# Altium schematic sheet jetson_nano_module.SchDoc: Jetson Nano Module
size A3; Author: Olexandr Gudozhnik; Organization: EPFL-STI-LIS; Address1: EPFL, Station 9; Address2: 1015, Lausanne; Address3: Switzerland; DocumentNumber: 3; SheetNumber: 3; SheetTotal: 8
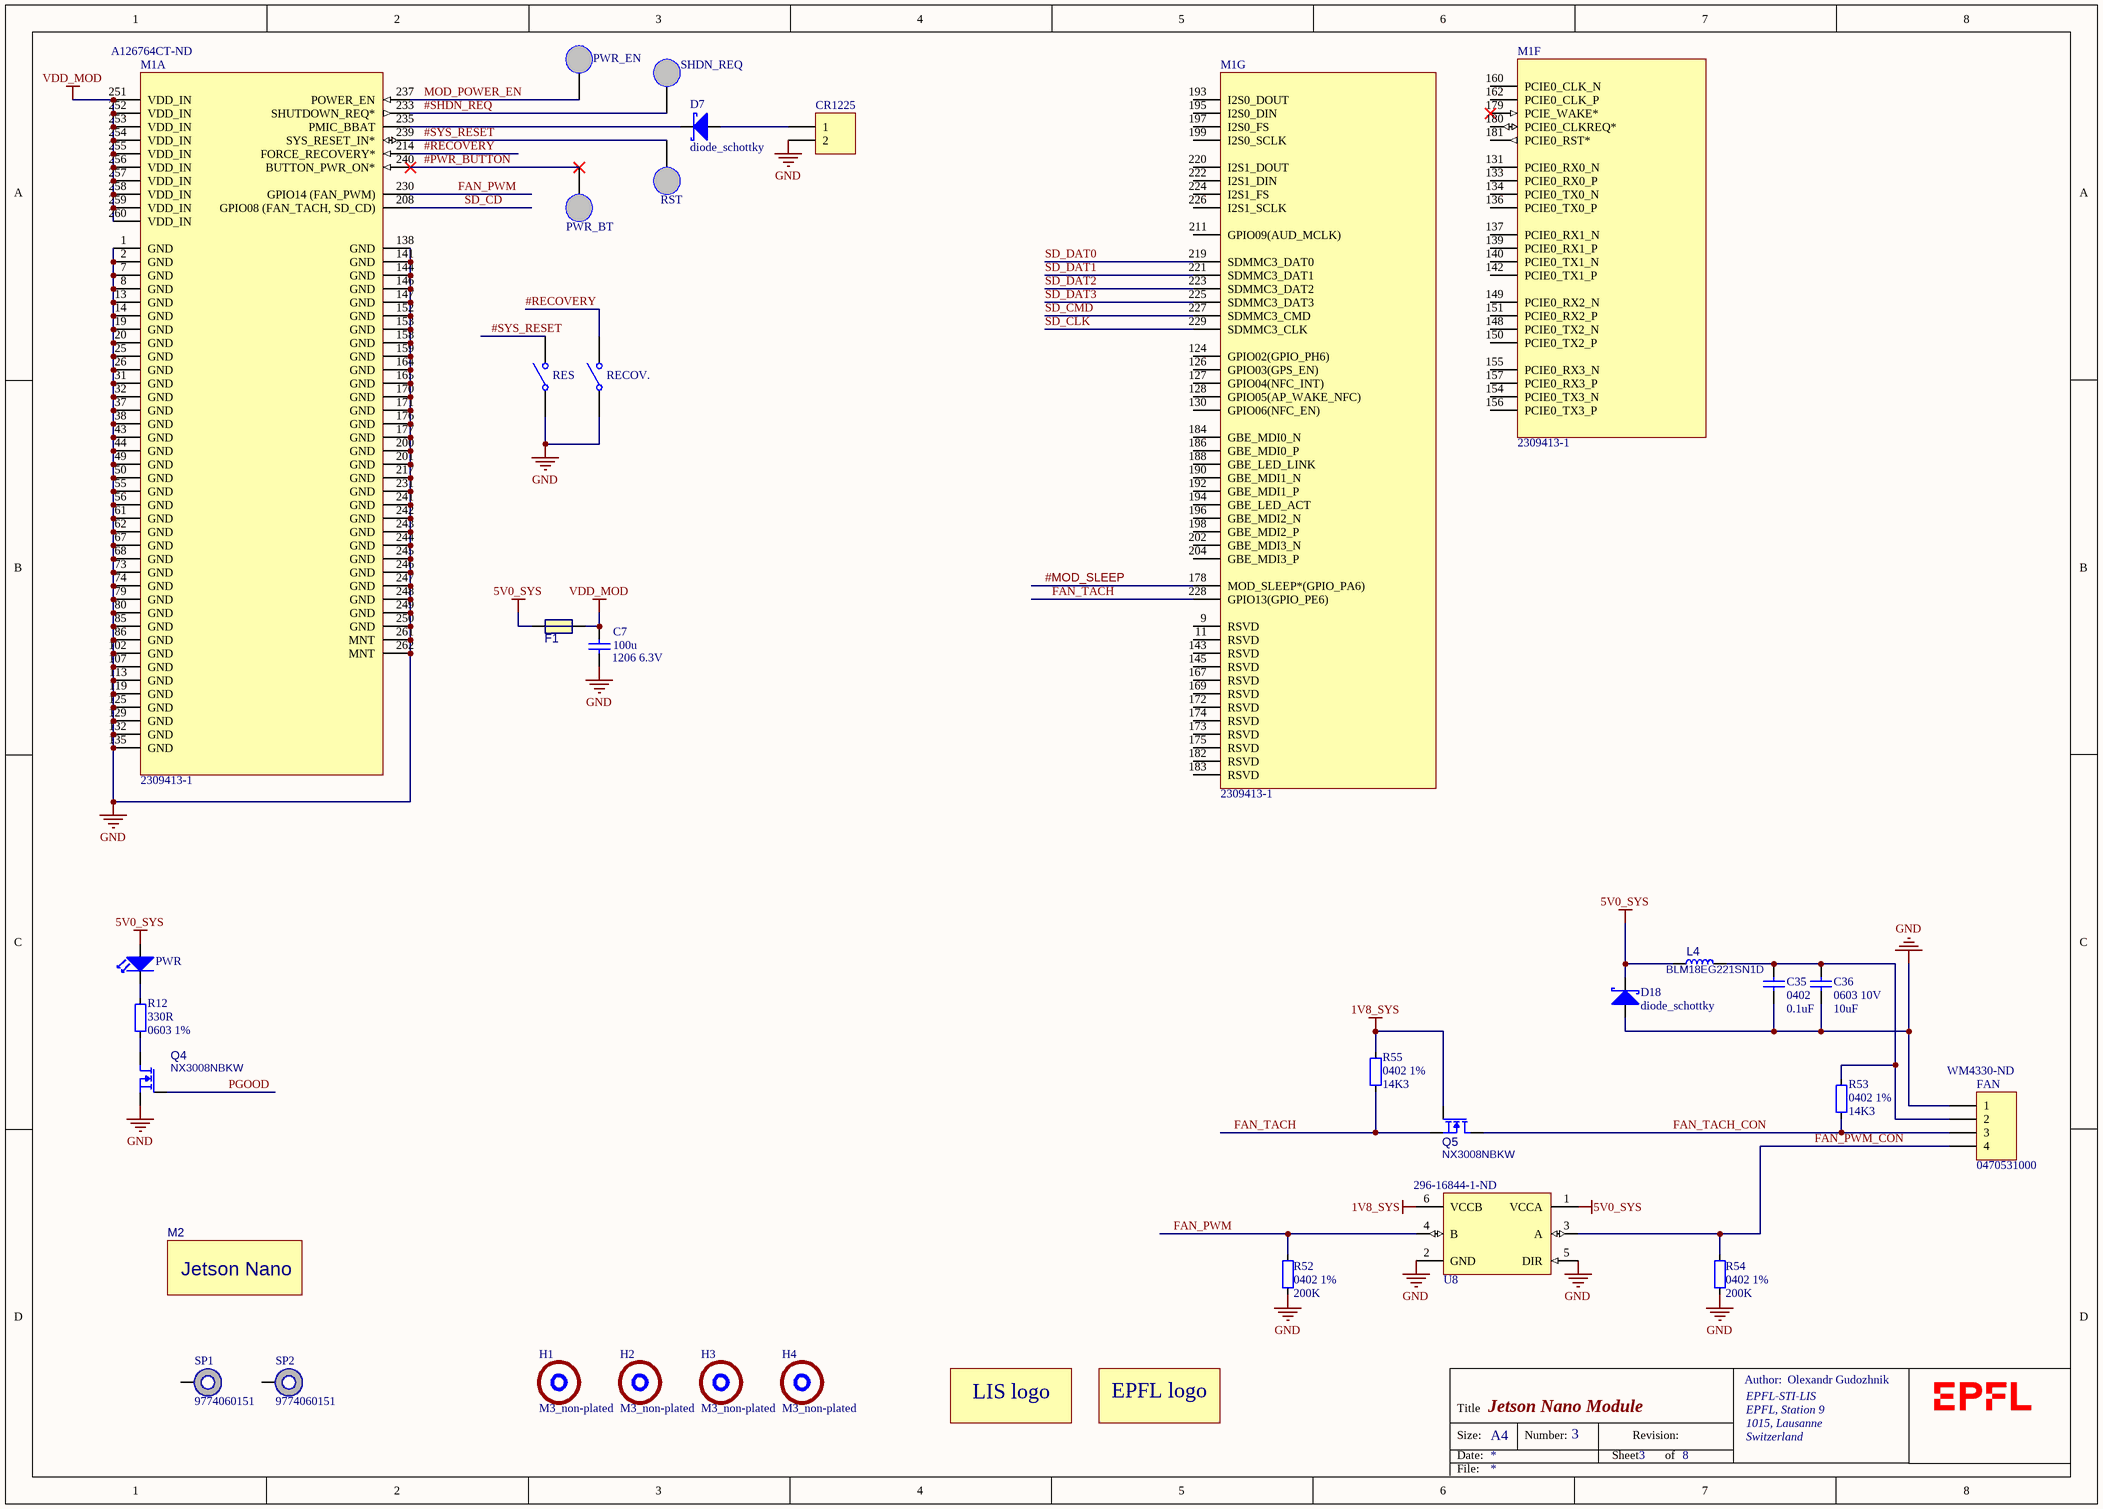
[diagram p0: jetson_nano_module.SchDoc]

## Parts
C7  1206 6.3V  value 100u  [cap1206]
C35  0402  value 0.1uF  [cap0402]
C36  0603 10V  value 10uF  [cap0603]
CR1225  Header 2  [CR1225_Holder]  (value not drawn)
D7  diode_schottky  [DFN1608D-2]
D18  diode_schottky  [DFN1608D-2]
F1  1206L450SLWR  [res1206]  (value not drawn)
FAN  0470531000  Supplier Part Number 1: WM4330-ND  [47053-1000]
H1  M3_non-plated  [M3_NON_PLATED]  (no BOM)
H2  M3_non-plated  [M3_NON_PLATED]  (no BOM)
H3  M3_non-plated  [M3_NON_PLATED]  (no BOM)
H4  M3_non-plated  [M3_NON_PLATED]  (no BOM)
L4  BLM18EG221SN1D  [fb0603]
logo1  LIS_LOGO  [lis_logo]  (value not drawn)  (graphical)
logo2  EPFL_LOGO  [epfl_logo]  (value not drawn)  (graphical)
M1  2309413-1  Supplier Part Number 1: A126764CT-ND  [jetson-nano-connector]  (parts A,F,G of 7)
M2  (no value)  [jetson-nano-module]  (no BOM)
PWR  green LED  [led_0603]  (value not drawn)
PWR_BT  TP  [test_point]  (value not drawn)  (no BOM)
PWR_EN  TP  [test_point]  (value not drawn)  (no BOM)
Q4  NX3008NBKW  [SC70-3]
Q5  NX3008NBKW  [SC70-3]
R12  0603 1%  value 330R  [res0603]
R52  0402 1%  value 200K  [res0402]
R53  0402 1%  value 14K3  [res0402]
R54  0402 1%  value 200K  [res0402]
R55  0402 1%  value 14K3  [res0402]
RECOV.  B3U1000P  [b3u_1000p]  (value not drawn)
RES  B3U1000P  [b3u_1000p]  (value not drawn)
RST  TP  [test_point]  (value not drawn)  (no BOM)
SHDN_REQ  TP  [test_point]  (value not drawn)  (no BOM)
SP1  9774060151  [M2.5-6mm]  (mechanical)
SP2  9774060151  [M2.5-6mm]  (mechanical)
U8  Supplier Part Number 1: 296-16844-1-ND  [SC70-6]  (hidden comment: SN74LVC1T45)

## Nets
1V8_SYS: Q5.1(G) R55.1 U8.6(VCCB)
5V0_SYS: D18.1(K) F1.1 L4.1 PWR.1(A) U8.1(VCCA)
GND: C7.2 C35.1 C36.2 CR1225.2 D18.2(A) FAN.1 M1.1(GND) M1.2(GND) M1.7(GND) M1.8(GND) M1.13(GND) M1.14(GND) M1.19(GND) M1.20(GND) M1.25(GND) M1.26(GND) M1.31(GND) M1.32(GND) M1.37(GND) M1.38(GND) M1.43(GND) M1.44(GND) M1.49(GND) M1.50(GND) M1.55(GND) M1.56(GND) M1.61(GND) M1.62(GND) M1.67(GND) M1.68(GND) M1.73(GND) M1.74(GND) M1.79(GND) M1.80(GND) M1.85(GND) M1.86(GND) M1.102(GND) M1.107(GND) M1.113(GND) M1.119(GND) M1.125(GND) M1.129(GND) M1.132(GND) M1.135(GND) M1.138(GND) M1.141(GND) M1.144(GND) M1.146(GND) M1.147(GND) M1.152(GND) M1.153(GND) M1.158(GND) M1.159(GND) M1.164(GND) M1.165(GND) M1.170(GND) M1.171(GND) M1.176(GND) M1.177(GND) M1.200(GND) M1.201(GND) M1.217(GND) M1.231(GND) M1.241(GND) M1.242(GND) M1.243(GND) M1.244(GND) M1.245(GND) M1.246(GND) M1.247(GND) M1.248(GND) M1.249(GND) M1.250(GND) M1.261(MNT) M1.262(MNT) Q4.2(S) R52.2 R54.2 RECOV..1(COMMON) RES.1(COMMON) U8.2(GND) U8.5(DIR)
VDD_MOD: C7.1 F1.2 M1.251(VDD_IN) M1.252(VDD_IN) M1.253(VDD_IN) M1.254(VDD_IN) M1.255(VDD_IN) M1.256(VDD_IN) M1.257(VDD_IN) M1.258(VDD_IN) M1.259(VDD_IN) M1.260(VDD_IN)
#MOD_SLEEP: M1.178(MOD_SLEEP*(GPIO_PA6))
#PWR_BUTTON: M1.240(BUTTON_PWR_ON*) PWR_BT.1(TP)
#RECOVERY: M1.214(FORCE_RECOVERY*) RECOV..2(NO)
#SHDN_REQ: M1.233(SHUTDOWN_REQ*) SHDN_REQ.1(TP)
#SYS_RESET: M1.239(SYS_RESET_IN*) RES.2(NO) RST.1(TP)
FAN_PWM: M1.230(GPIO14_(FAN_PWM)) R52.1 U8.4(B)
FAN_PWM_CON: FAN.4 R54.1 U8.3(A)
FAN_TACH: M1.228(GPIO13(GPIO_PE6)) Q5.2(S) R55.2
FAN_TACH_CON: FAN.3 Q5.3(D) R53.2
MOD_POWER_EN: M1.237(POWER_EN) PWR_EN.1(TP)
PGOOD: Q4.1(G)
SD_CD: M1.208(GPIO08_(FAN_TACH,_SD_CD))
SD_CLK: M1.229(SDMMC3_CLK)
SD_CMD: M1.227(SDMMC3_CMD)
SD_DAT0: M1.219(SDMMC3_DAT0)
SD_DAT1: M1.221(SDMMC3_DAT1)
SD_DAT2: M1.223(SDMMC3_DAT2)
SD_DAT3: M1.225(SDMMC3_DAT3)
NetC35_2: C35.2 C36.1 FAN.2 L4.2 R53.1
NetCR1225_1: CR1225.1 D7.2(A)
NetD7_1: D7.1(K) M1.235(PMIC_BBAT)
NetPWR_2: PWR.2(K) R12.2
NetQ4_3: Q4.3(D) R12.1

Not connected (* = marked no-connect by the designer): M1 9(RSVD) 11(RSVD) 124(GPIO02(GPIO_PH6)) 126(GPIO03(GPS_EN)) 127(GPIO04(NFC_INT)) 128(GPIO05(AP_WAKE_NFC)) 130(GPIO06(NFC_EN)) 131(PCIE0_RX0_N) 133(PCIE0_RX0_P) 134(PCIE0_TX0_N) 136(PCIE0_TX0_P) 137(PCIE0_RX1_N) 139(PCIE0_RX1_P) 140(PCIE0_TX1_N) 142(PCIE0_TX1_P) 143(RSVD) 145(RSVD) 148(PCIE0_TX2_N) 149(PCIE0_RX2_N) 150(PCIE0_TX2_P) 151(PCIE0_RX2_P) 154(PCIE0_TX3_N) 155(PCIE0_RX3_N) 156(PCIE0_TX3_P) 157(PCIE0_RX3_P) 160(PCIE0_CLK_N) 162(PCIE0_CLK_P) 167(RSVD) 169(RSVD) 172(RSVD) 173(RSVD) 174(RSVD) 175(RSVD) 179(PCIE_WAKE*)* 180(PCIE0_CLKREQ*) 181(PCIE0_RST*) 182(RSVD) 183(RSVD) 184(GBE_MDI0_N) 186(GBE_MDI0_P) 188(GBE_LED_LINK) 190(GBE_MDI1_N) 192(GBE_MDI1_P) 193(I2S0_DOUT) 194(GBE_LED_ACT) 195(I2S0_DIN) 196(GBE_MDI2_N) 197(I2S0_FS) 198(GBE_MDI2_P) 199(I2S0_SCLK) 202(GBE_MDI3_N) 204(GBE_MDI3_P) 211(GPIO09(AUD_MCLK)) 220(I2S1_DOUT) 222(I2S1_DIN) 224(I2S1_FS) 226(I2S1_SCLK); SP1 1; SP2 1

## Notes on the sheet
- Author:
- Title
- Size:
- Date:
- A4
- Number:
- Sheet
- Revision:
- of
- File:
- (in symbol EPFL_LOGO) EPFL logo
- (in symbol jetson-nano-module) Jetson Nano
- (in symbol LIS_LOGO) LIS logo

## Library data of the parts
C7 = cap_no_param: Supplier 1: Digi-Key; Supplier Part Number 1: 399-5620-1-ND
C35 C36 = cap: standard, non-polarized capacitor; Supplier 1: Digi-Key; Footprint verified: no
  C35: Supplier Part Number 1: 490-14603-1-ND; Supplier Price 1: 0.08
  C36: Supplier Part Number 1: 490-10474-1-ND; Supplier Price 1: 0.23
CR1225 = Header 2: Header, 2-Pin; LatestRevisionDate: 17-Jul-2002; LatestRevisionNote: Re-released for DXP Platform.; Publisher: Altium Limited; Supplier 1: Digi-Key; Supplier Part Number 1: 36-3000CT-ND
D7 D18 = diode_schottky: Schottky diode; Published: 8-Jun-2000; LatestRevisionDate: 17-Jul-2002; LatestRevisionNote: Re-released for DXP Platform.; PackageReference: SMB; Publisher: Altium Limited; PackageDescription: DO-214-AA/SMB; 2 C-Bend Leads; Body 5.3 x 3.6 mm, inc. leads (LxW); Code_JEDEC: DO-214-AA; Supplier 1: Digi-Key; Supplier Part Number 1: 1727-1338-1-ND
F1 = Fuse: PTC RESET 6V LO RHO 1206 4.50A; PartNumber: LITTELFUSE_1206L450SLWR; Manufacturer: LITTELFUSE; Value: 1206L450SLWR; PartSymbol: 1206L450SLWR; Supplier 1: Digi-Key; Supplier Part Number 1: F5787CT-ND
FAN = Header 4: Fan header, 4-Pin; LatestRevisionDate: 17-Jul-2002; LatestRevisionNote: Re-released for DXP Platform.; Publisher: Altium Limited; Supplier 1: Digi-Key
H1-H4 = M3_non-plated_hole
L4 = BLM18EG221SN1D: MURATA  BLM18EG221SN1D  FERRITE BEAD, 0.05OHM, 2A, 0603; Value: BLM18EG221SN1D; Manufacturer: MURATA; PartNumber: BLM18EG221SN1D; PartSymbol: BLM18EG221SN1D; Supplier 1: Digi-Key; Supplier Part Number 1: 490-3992-1-ND
M1 = 2309413-1: Memory Socket, DDR4, SODIMM Socket, 260 Contacts, Copper Alloy, Gold Plated Contacts; Manufacturer: TE CONNECTIVITY; PartNumber: 2309413-1; Value: 2309413-1; PartSymbol: 2309413-1; Supplier 1: Digi-Key
M2 = jetson-nano-module: PartNumber: jetson-nano-module
PWR = diode_LED: Green LED 0603; Supplier 1: Digi-Key; Supplier Part Number 1: 475-2709-1-ND
PWR_BT PWR_EN RST SHDN_REQ = TP: Test point
Q4 Q5 = NMOS: MOSFET, N CH, 60V, 0.2A; Manufacturer: NXP; PartSymbol: BSS138PW; Value: NX3008NBKW; PartNumber: NX3008NBKW; Supplier 1: Digi-Key; Supplier Part Number 1: 1727-1280-1-ND
R12 R53 R55 = res: Supplier 1: Digi-Key
  R12: Supplier Part Number 1: 311-330HRCT-ND
  R53 R55: Supplier Part Number 1: P14.3KLCT-ND
R52 R54 = res: 100K; Supplier 1: Digi-Key
  R52: Supplier Part Number 1: P200KLCT-ND
  R54: Supplier Part Number 1: P100KLCT-ND
RECOV. RES = SW-SPST: Single-Pole, Single-Throw Switch; Published: 24-Mar-1999; LatestRevisionDate: 17-Jul-2002; LatestRevisionNote: Re-released for DXP Platform.; PackageReference: SPST-2; Publisher: Altium Limited; PackageDescription: Switch; 2 Leads; Supplier 1: Digi-Key; Supplier Part Number 1: SW1020CT-ND
SP1 SP2 = SPACER: M2.5-6mm; PartNumber: M2.5x6; Manufacturer: WURTH ELEKTRONIK; Value: 9774060151; PartSymbol: 9774060151; Supplier 1: Digi-Key; Supplier Part Number 1: 732-12984-ND
U8 = SN74LVC1T45: 1.8 - 5.5V fast level translator; Supplier 1: Digi-Key